# EAGLE design ArduFrauenfelderCNC_0.1-b6 (EAGLE 6.0)
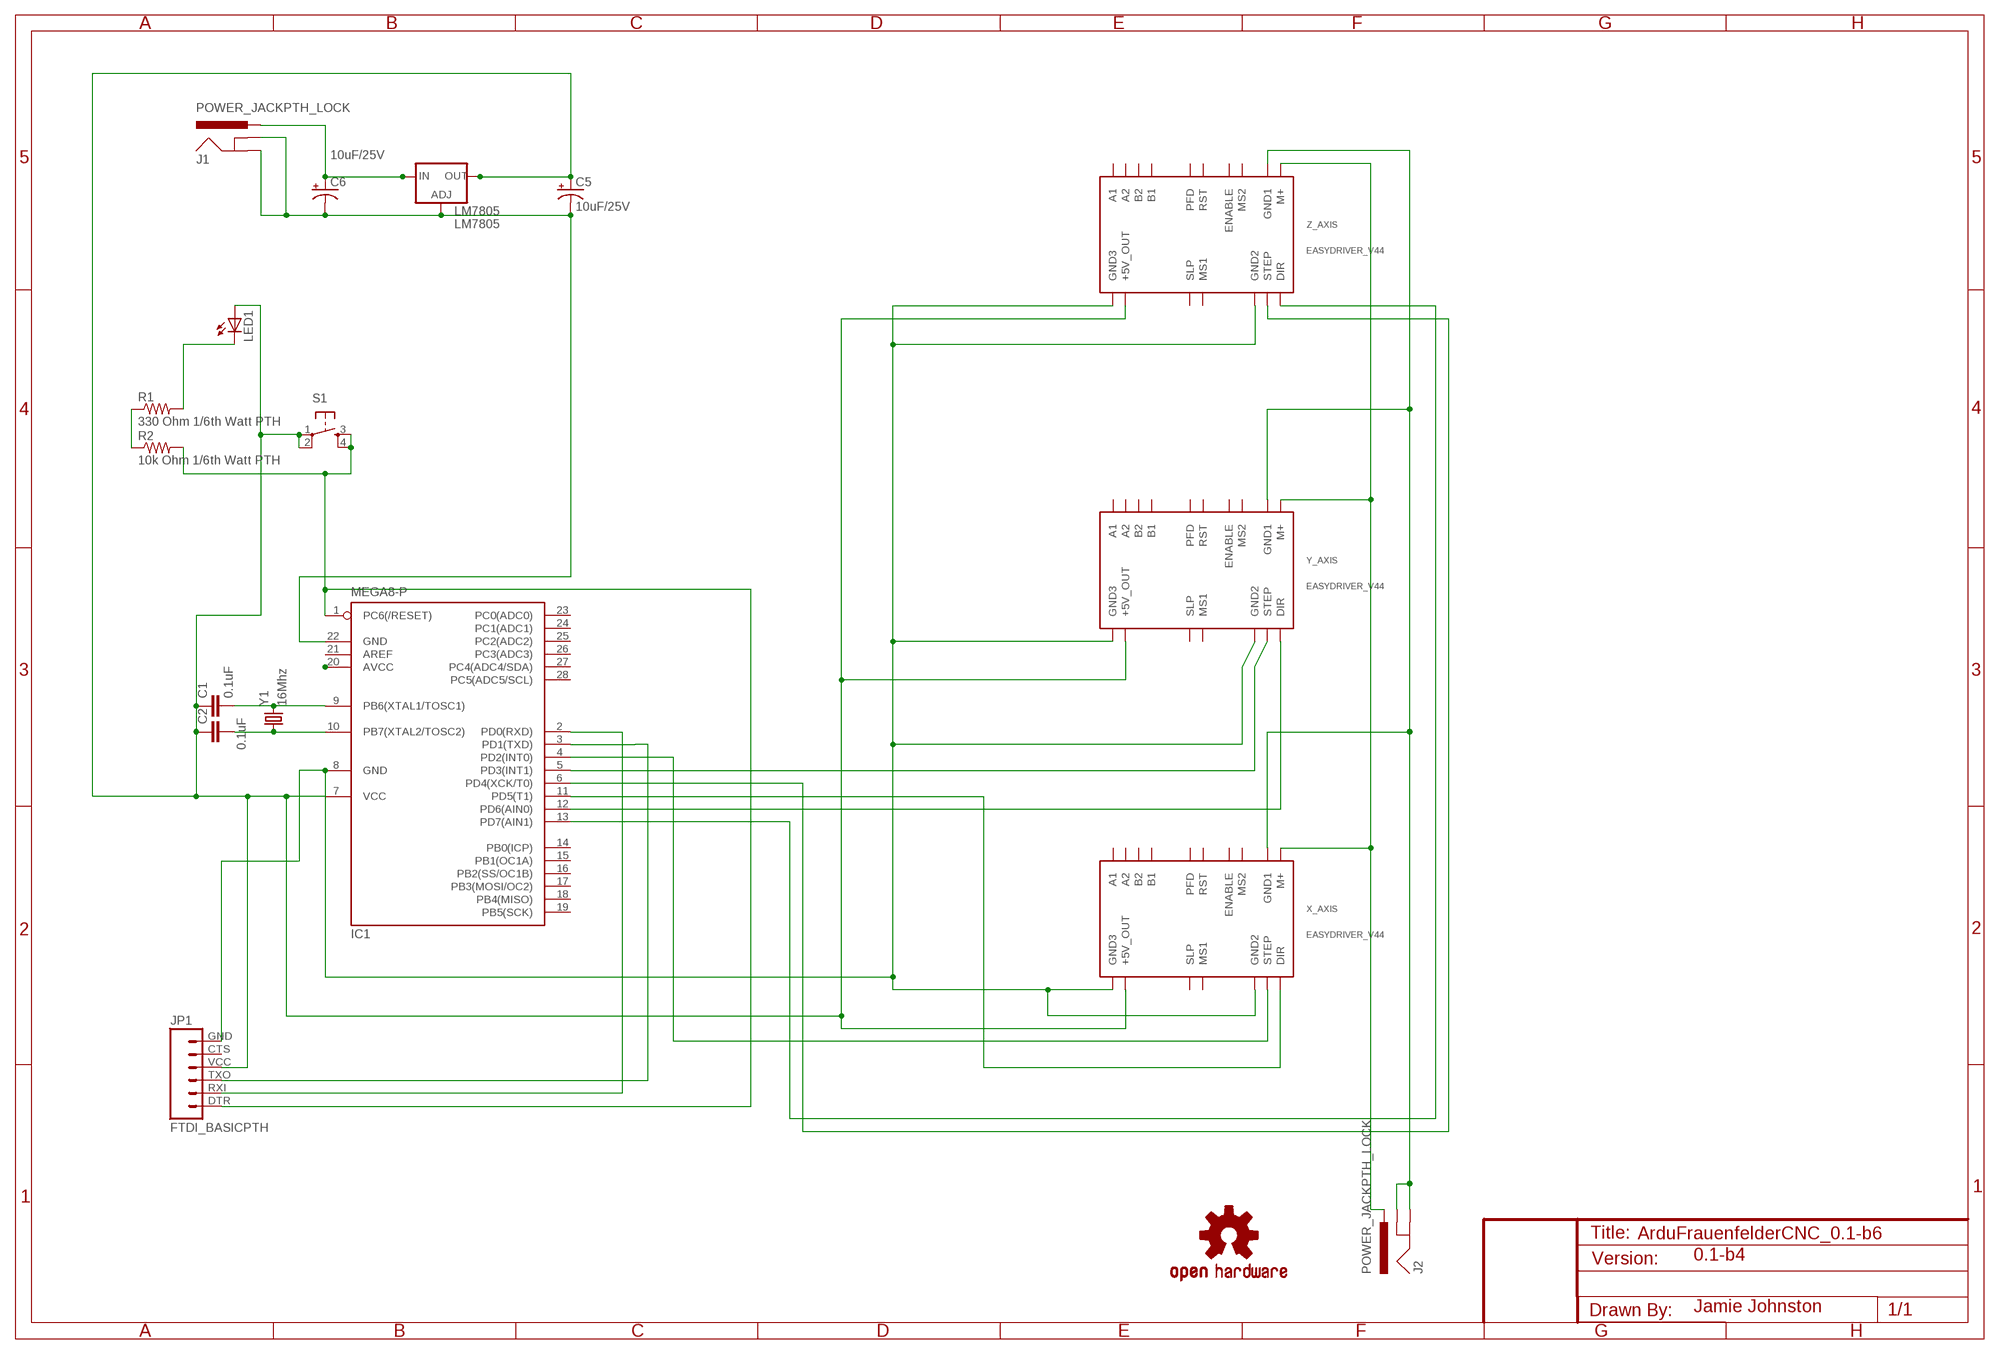
[diagram p0: schematic, sheet 1]

## Parts
C1  0.1uF  CAPPTH  [CAP-PTH-SMALL]
C2  0.1uF  CAPPTH  [CAP-PTH-SMALL]
C5  10uF/25V  CAP_POLPTH2  [CPOL-RADIAL-10UF-25V]
C6  10uF/25V  CAP_POLPTH2  [CPOL-RADIAL-10UF-25V]
IC1  MEGA8-P  [DIL28-3]
J1  POWER_JACKPTH_LOCK  [POWER_JACK_PTH_LOCK]
J2  POWER_JACKPTH_LOCK  [POWER_JACK_PTH_LOCK]
JP1  FTDI_BASICPTH  [FTDI_BASIC]
LED1  LED5MM  [LED5MM]
LM7805  LM7805  V_REG_317SINK  [TO220-ADJ]
R1  330 Ohm 1/6th Watt PTH  RESISTORPTH-1/4W  [AXIAL-0.4]
R2  10k Ohm 1/6th Watt PTH  RESISTORPTH-1/4W  [AXIAL-0.4]
S1  TAC_SWITCHPTH  [TACTILE-PTH]
U$2  OSHW-LOGOL  [OSHW-LOGO-L]
X_AXIS  EASYDRIVER_V44  [EASYDRIVER_V44]
Y1  16Mhz  CRYSTALHC49US  [HC49US]
Y_AXIS  EASYDRIVER_V44  [EASYDRIVER_V44]
Z_AXIS  EASYDRIVER_V44  [EASYDRIVER_V44]

## Nets
N$1: C1.2 IC1.9(PB6(XTAL1/TOSC1)) Y1.2
N$2: C2.2 IC1.10(PB7(XTAL2/TOSC2)) Y1.1
N$3: IC1.5(PD3(INT1)) Y_AXIS.STEP
N$4: LED1.K(C) R1.P$2
N$5: IC1.1(PC6(/RESET)) JP1.DTR R2.P$2 S1.3 S1.4
N$6: R1.P$1 R2.P$1
N$7: C6.1(+) J1.PWR LM7805.IN
N$8: J2.PWR X_AXIS.M+ Y_AXIS.M+ Z_AXIS.M+
N$9: IC1.8(GND) JP1.GND X_AXIS.GND2 X_AXIS.GND3 Y_AXIS.GND2 Y_AXIS.GND3 Z_AXIS.GND2 Z_AXIS.GND3
N$10: J2.GND J2.GNDBREAK X_AXIS.GND1 Y_AXIS.GND1 Z_AXIS.GND1
N$11: IC1.3(PD1(TXD)) JP1.TXO
N$12: IC1.2(PD0(RXD)) JP1.RXI
N$13: IC1.12(PD6(AIN0)) Y_AXIS.DIR
N$14: IC1.4(PD2(INT0)) X_AXIS.STEP
N$15: C5.2(-) C6.2(-) IC1.22(GND) J1.GND J1.GNDBREAK LM7805.ADJ
N$16: IC1.11(PD5(T1)) X_AXIS.DIR
N$17: C1.1 C2.1 C5.1(+) IC1.7(VCC) JP1.VCC LED1.A LM7805.OUT S1.1 S1.2 X_AXIS.P$11(+5V_OUT) Y_AXIS.P$11(+5V_OUT) Z_AXIS.P$11(+5V_OUT)
N$18: IC1.20(AVCC)
N$19: IC1.13(PD7(AIN1)) Z_AXIS.DIR
N$20: IC1.6(PD4(XCK/T0)) Z_AXIS.STEP
Unconnected: IC1.14(PB0(ICP)) IC1.15(PB1(OC1A)) IC1.16(PB2(SS/OC1B)) IC1.17(PB3(MOSI/OC2)) IC1.18(PB4(MISO)) IC1.19(PB5(SCK)) IC1.21(AREF) IC1.23(PC0(ADC0)) IC1.24(PC1(ADC1)) IC1.25(PC2(ADC2)) IC1.26(PC3(ADC3)) IC1.27(PC4(ADC4/SDA)) IC1.28(PC5(ADC5/SCL)) JP1.CTS X_AXIS.A1 X_AXIS.A2 X_AXIS.B1 X_AXIS.B2 X_AXIS.ENABLE X_AXIS.MS1 X_AXIS.MS2 X_AXIS.PFD X_AXIS.RST X_AXIS.SLEEP(SLP) Y_AXIS.A1 Y_AXIS.A2 Y_AXIS.B1 Y_AXIS.B2 Y_AXIS.ENABLE Y_AXIS.MS1 Y_AXIS.MS2 Y_AXIS.PFD Y_AXIS.RST Y_AXIS.SLEEP(SLP) Z_AXIS.A1 Z_AXIS.A2 Z_AXIS.B1 Z_AXIS.B2 Z_AXIS.ENABLE Z_AXIS.MS1 Z_AXIS.MS2 Z_AXIS.PFD Z_AXIS.RST Z_AXIS.SLEEP(SLP)

## Notes on the sheet
- 0.1-b4
- Jamie Johnston

## Library data of the parts
C1 C2 = SparkFun:CAP: Capacitor Standard 0603 ceramic capacitor, and 0.1" leaded capacitor.
C5 C6 = SparkFun:CAP_POL: Capacitor Polarized These are standard SMD and PTH capacitors. Normally 10uF, 47uF, and 100uF in electrolytic and tantalum varieties. Always verify the external diameter of the through hole cap, it varies with capacity, voltage, and manufacturer. The EIA devices should be standard.
IC1 = atmel:MEGA8-P: MICROCONTROLLER 8 Kbytes FLASH, 1 kbytes SRAM, 512 bytes EEPROM, USART, 4-channel 10 bit ADC, 2-channel 8 bit ADC Pin compatible with Atmega48, ATMega88, ATMega168 Source: avr.lbr; OC_FARNELL: unknown; OC_NEWARK: unknown
J1 J2 = SparkFun:POWER_JACK: Power Jack This is the standard 5.5mm barrel jack for power. The PTH is the most common, proven, reliable, footprint. All others are experimental. The Slot footprint only works if the mill layer is transmitted to the PCB fab house so be warned. Spark Fun Electronics SKU : PRT-00119. Mating wall wart : TOL-00298 (and others)
JP1 = SparkFun:FTDI_BASIC: FTDI Basic: 3.3V and 5V
LED1 = SparkFun:LED: LEDs Standard schematic elements and footprints for 5mm, 3mm, 1206, and 0603 sized LEDs. 5mm - Spark Fun Electronics SKU : COM-00529 (and others)
LM7805 = SparkFun:V_REG_317: Voltage Regulator Standard LM317 adjustable voltage regulator. AOI (Adjust Output Input). Google 'LM317 Calculator' for easy to use app to get the two resistor values needed. 240/720 for 5V output. 240/390 for 3.3V output. Spark Fun Electronics SKU : COM-00527
R1 R2 = SparkFun:RESISTOR: Resistor Basic schematic elements and footprints for 0603, 1206, and PTH resistors.
S1 = SparkFun:TAC_SWITCH: Momentary Switch Button commonly used for reset or general input. Spark Fun Electronics SKU : COM-00097
U$2 = SparkFun:OSHW-LOGO: Open Source Hardware Logo This logo indicates the piece of hardware it is found on incorporates a OSHW license and/or adheres to the definition of open source hardware found here: http://freedomdefined.org/OSHW
X_AXIS Y_AXIS Z_AXIS = EasyDriver:EASYDRIVER_V44: EasyDriver version 4.4 - http://www.schmalzhaus.com/EasyDriver
Y1 = SparkFun:CRYSTAL: Crystals Various standard crystals. Proven footprints. Spark Fun Electronics SKU : COM-00534

## Board
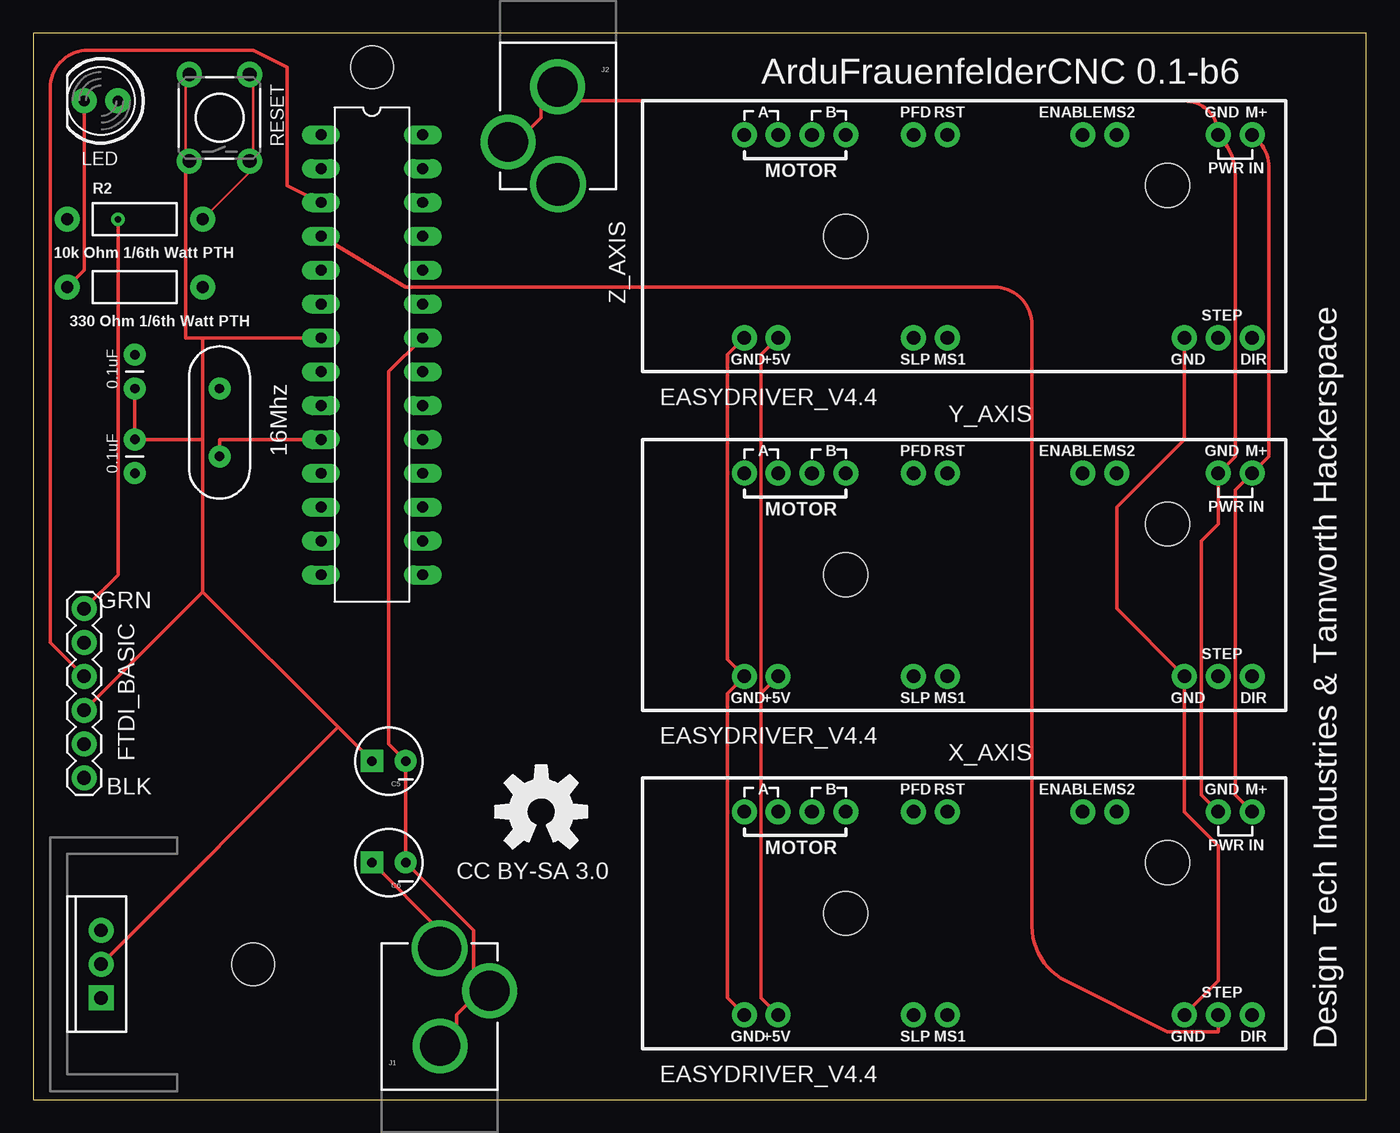
[diagram p1: board, top side]
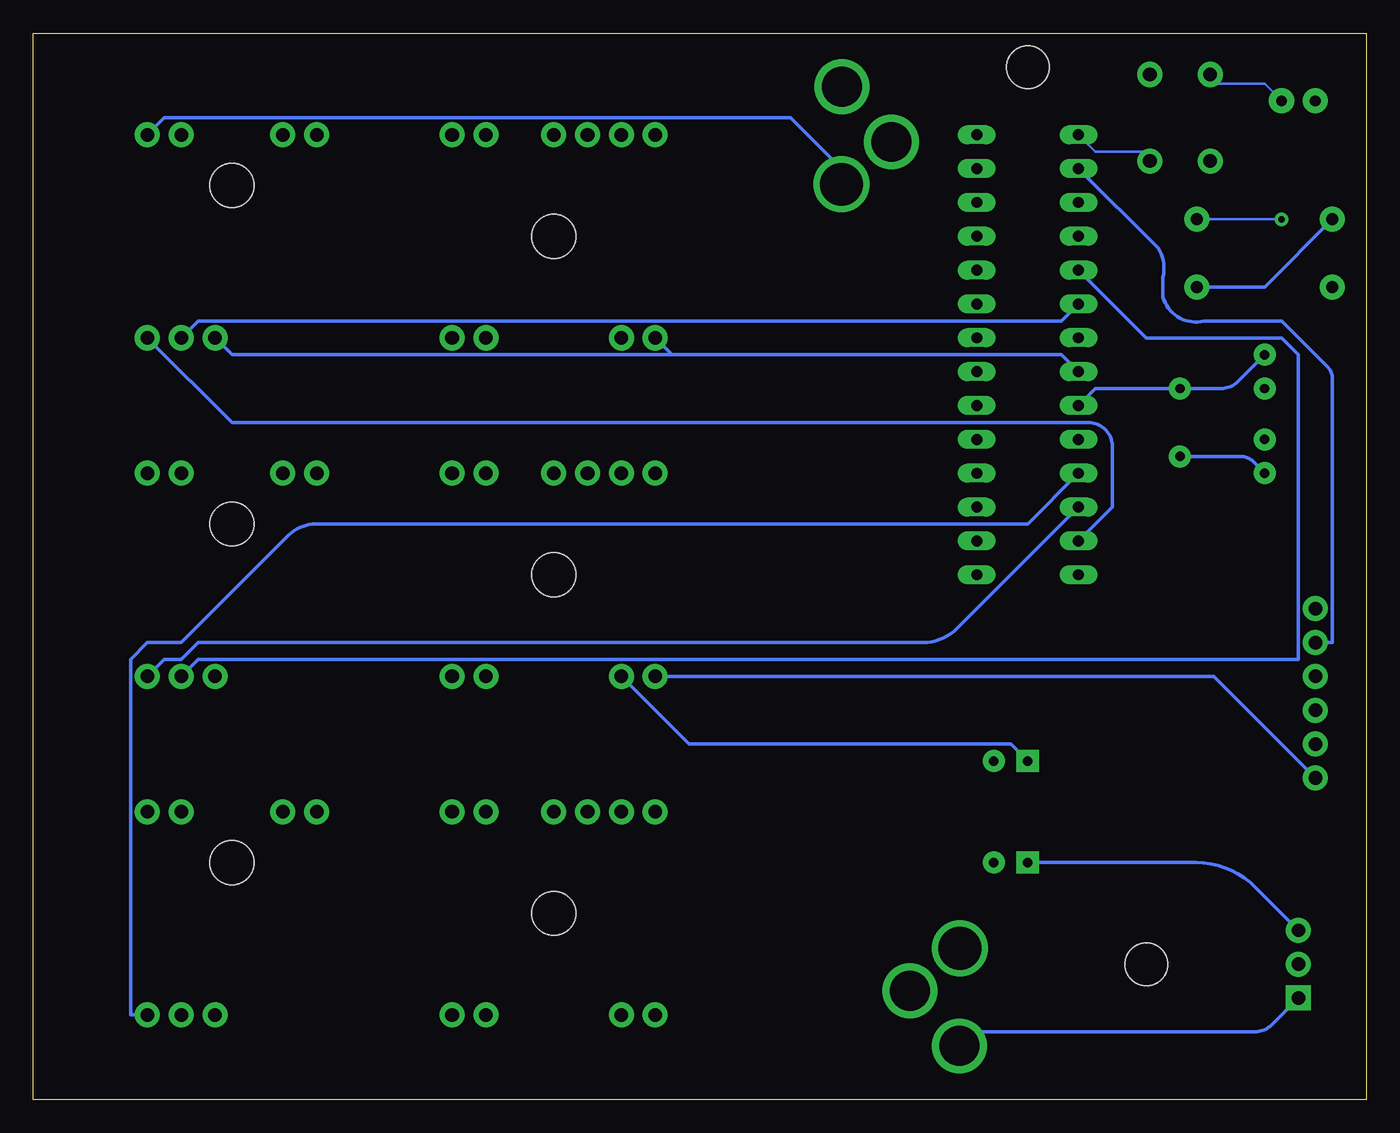
[diagram p2: board, bottom side, seen from below]

Size 100 x 80 mm. Coordinates in mm from the lower left corner, seen from the top.
Outline: 0,0 100,0 100,80 0,80 0,0
Copper layers (1*16): Top 0.035mm / dielectric 1.5mm / Bottom 0.035mm
Design rules: minimum track width 8mil, minimum drill 20mil, track to track 8mil, track to pad 8mil, pad to pad 8mil, via to via 8mil, smd to smd 8mil, copper to edge 10mil, drill to drill 8mil, minimum pad ring 12mil, minimum via ring 10mil, stop-mask expansion 4mil, vias tented up to drill 25mil, thermal gap 10mil
Holes 3.2 mm at 16.51,10.16 25.4,77.47

### Footprints (pad centres in the part's own frame; a part is rotated, then mirrored left to right if it is on the bottom)
CAP-PTH-SMALL = drill 0.7 pad 1.651: 1 0,0; 2 2.54,0
CPOL-RADIAL-10UF-25V = drill 0.7 pad 1.651 square: 1 1.27,0 | drill 0.7 pad 1.651: 2 -1.27,0
DIL28-3 = drill 0.813 long: 1 -16.51,-3.81; 2 -13.97,-3.81; 3 -11.43,-3.81; 4 -8.89,-3.81; 5 -6.35,-3.81; 6 -3.81,-3.81; 7 -1.27,-3.81; 8 1.27,-3.81; 9 3.81,-3.81; 10 6.35,-3.81; 11 8.89,-3.81; 12 11.43,-3.81; 13 13.97,-3.81; 14 16.51,-3.81; 15 16.51,3.81; 16 13.97,3.81; 17 11.43,3.81; 18 8.89,3.81; 19 6.35,3.81; 20 3.81,3.81; 21 1.27,3.81; 22 -1.27,3.81; 23 -3.81,3.81; 24 -6.35,3.81; 25 -8.89,3.81; 26 -11.43,3.81; 27 -13.97,3.81; 28 -16.51,3.81
POWER_JACK_PTH_LOCK = drill 2.997 pad 4.115: GND 0.025,6.557; GNDBREAK 3.762,10.7 | drill 3.2 pad 4.115: PWR 0,13.878
FTDI_BASIC = drill 1.016 pad 1.88: CTS 10.16,0; DTR 0,0; GND 12.7,0; RXI 2.54,0; TXO 5.08,0; VCC 7.62,0
LED5MM = drill 0.813 pad 1.88: A -1.27,0; K 1.27,0
TO220-ADJ = drill 1 pad 1.88 square: ADJ -2.54,0 | drill 1 pad 1.88: IN 2.54,0; OUT 0,0
AXIAL-0.4 = drill 0.9 pad 1.88: P$1 -5.08,0; P$2 5.08,0
TACTILE-PTH = drill 1.016 pad 1.88: 1 -3.251,2.261; 2 3.251,2.261; 3 -3.251,-2.261; 4 3.251,-2.261
EASYDRIVER_V44 = drill 1.016 pad 1.88: A1 -16.51,7.62; A2 -13.97,7.62; B1 -8.89,7.62; B2 -11.43,7.62; DIR 21.59,-7.62; ENABLE 8.89,7.62; GND1 19.05,7.62; GND2 16.51,-7.62; GND3 -16.51,-7.62; M+ 21.59,7.62; MS1 -1.27,-7.62; MS2 11.43,7.62; P$11 -13.97,-7.62; PFD -3.81,7.62; RST -1.27,7.62; SLEEP -3.81,-7.62; STEP 19.05,-7.62 | hole 3.302: 15.24,3.81; -8.89,0
HC49US = drill 0.7 pad 1.651: 1 -2.54,0; 2 2.54,0

### Placement (x,y rotation side)
C1  7.62,53.34 90 top
C2  7.62,49.53 270 top
C5  26.67,25.4 180 top
C6  26.67,17.78 180 top
IC1  25.4,55.88 270 top
J1  30.48,-2.54 0 top
J2  39.37,82.55 180 top
JP1  3.81,36.83 270 top
LED1  5.08,74.93 180 top
LM7805  5.08,10.16 90 top
R1  7.62,60.96 180 top
R2  7.62,66.04 0 top
S1  13.97,73.66 90 top
U$2  38.1,21.59 0 top
X_AXIS  69.85,13.97 0 top
Y1  13.97,50.8 90 top
Y_AXIS  69.85,39.37 0 top
Z_AXIS  69.85,64.77 0 top

### Tracks (layer width: path | path; a pad name or v marks a point on that pad's centre or on a via)
N$1
  Bottom 0.254: IC1.9 20.32,53.34 Y1.2 10.9,53.34 arc-45 9.63,53.87 C1.2
N$2
  Top 0.254: IC1.10 13.97,49.53 Y1.1
  Bottom 0.254: C2.2 8.52,47.89 arc-45 9.42,48.26 Y1.1
N$3
  Bottom 0.254: IC1.5 16.51,57.15 6.35,57.15 5.08,55.88 5.08,33.02 87.63,33.02 Y_AXIS.STEP
N$4
  Top 0.254: R1.P$2 3.81,62.23 LED1.K
N$5  (via drill 0.51)
  Top 0.203: R2.P$2 16.51,69.85 S1.3 16.51,71.12 16.51,76.2 S1.4
  Top 0.254: JP1.DTR 6.35,39.37 v6.35,66.04
  Bottom 0.203: v6.35,66.04 R2.P$2 | IC1.1 20.32,71.12 16.51,71.12 S1.3
N$6
  Bottom 0.254: R2.P$1 7.62,60.96 R1.P$1
N$7
  Top 0.254: C6.1 30.48,12.7 J1.PWR
  Bottom 0.254: LM7805.IN 8.3,15.92 arc-45 12.79,17.78 C6.1
N$8
  Top 0.254: X_AXIS.M+ 90.17,22.86 90.17,45.72 Y_AXIS.M+ 92.71,48.26 92.71,69.94 arc45 91.88,71.95 Z_AXIS.M+
  Bottom 0.254: Z_AXIS.M+ 90.17,73.66 43.18,73.66 39.37,69.85 J2.PWR
N$9
  Top 0.254: X_AXIS.GND3 52.07,7.62 52.07,30.48 Y_AXIS.GND3 52.07,33.02 52.07,55.88 Z_AXIS.GND3 | X_AXIS.GND2 88.9,8.89 88.9,19.05 86.36,21.59 Y_AXIS.GND2 81.28,36.83 81.28,44.45 86.36,49.53 Z_AXIS.GND2
  Bottom 0.254: JP1.GND 11.43,31.75 Y_AXIS.GND3 | IC1.8 22.86,55.88 52.07,55.88 | Z_AXIS.GND3 52.07,55.88 | Z_AXIS.GND2 85.09,55.88 52.07,55.88
N$10
  Top 0.254: J2.GNDBREAK 36.83,72.39 38.1,73.66 38.1,74.93 J2.GND 39.37,74.93 86.36,74.93 arc-90 Z_AXIS.GND1 arc-45 90.17,69.32 90.17,48.26 Y_AXIS.GND1 88.9,43.18 87.63,41.91 87.63,22.86 X_AXIS.GND1
N$11
  Top 0.254: IC1.3 19.05,68.58 19.05,77.47 16.51,78.74 4.11,78.74 arc90 1.27,75.9 1.27,34.29 JP1.TXO
N$12
  Bottom 0.254: IC1.2 15.61,63.87 arc45 15.24,61.7 15.24,60.22 arc-90 12.17,58.42 6.35,58.42 2.91,54.98 arc45 2.54,54.08 2.54,34.29 JP1.RXI
N$13
  Bottom 0.254: IC1.12 30.7,35.34 arc45 33.24,34.29 87.63,34.29 88.9,33.02 90.17,33.02 Y_AXIS.DIR
N$14
  Top 0.254: IC1.4 27.94,60.96 72.09,60.96 arc-90 74.93,58.12 74.93,12.99 arc63 77.46,8.89 85.09,5.08 88.9,5.08 X_AXIS.STEP
N$15
  Top 0.254: IC1.22 26.67,54.61 26.67,26.67 C5.2 C6.2 33.02,12.7 33.02,8.89 J1.GNDBREAK 33.02,7.62 31.75,6.35 31.75,5.08 J1.GND
  Bottom 0.254: LM7805.ADJ 7.09,5.61 arc45 8.36,5.08 30.48,5.08 J1.GND
N$16
  Bottom 0.254: IC1.11 25.4,43.18 78.83,43.18 arc-45 80.84,42.35 88.9,34.29 91.44,34.29 92.71,33.02 92.71,6.35 X_AXIS.DIR
N$17
  Top 0.203: S1.2 11.43,76.2 11.43,71.12 S1.1
  Top 0.254: X_AXIS.P$11 54.61,7.62 54.61,30.48 | Y_AXIS.P$11 54.61,30.48 | Z_AXIS.P$11 54.61,55.88 54.61,30.48 | C1.1 C2.1 12.7,49.53 | 12.7,57.15 11.43,57.15 11.43,69.85 S1.1 | 12.7,57.15 IC1.7 | 22.86,27.94 12.7,38.1 | 22.86,27.94 C5.1 | 12.7,49.53 12.7,57.15 | 12.7,38.1 12.7,49.53 | LM7805.OUT 22.86,27.94 | 12.7,38.1 JP1.VCC
  Bottom 0.203: LED1.A 7.62,76.2 11.43,76.2 S1.2
  Bottom 0.254: Y_AXIS.P$11 50.8,26.67 26.67,26.67 C5.1
N$19
  Bottom 0.254: IC1.13 19.05,44.45 19.05,49 arc-90 20.85,50.8 85.09,50.8 Z_AXIS.DIR
N$20
  Bottom 0.254: IC1.6 22.86,58.42 87.63,58.42 Z_AXIS.STEP

### Text on the board
tPlace: RESET | ArduFrauenfelderCNC 0.1-b6 | LED | Z_AXIS | 0.1uF | EASYDRIVER_V4.4 | Y_AXIS | 16Mhz | 0.1uF | GRN | EASYDRIVER_V4.4 | X_AXIS | FTDI_BASIC | BLK | CC BY-SA 3.0 | Design Tech Industries & Tamworth Hackerspace | EASYDRIVER_V4.4